# EAGLE schematic esp-4relay-board (EAGLE 7.7.0)
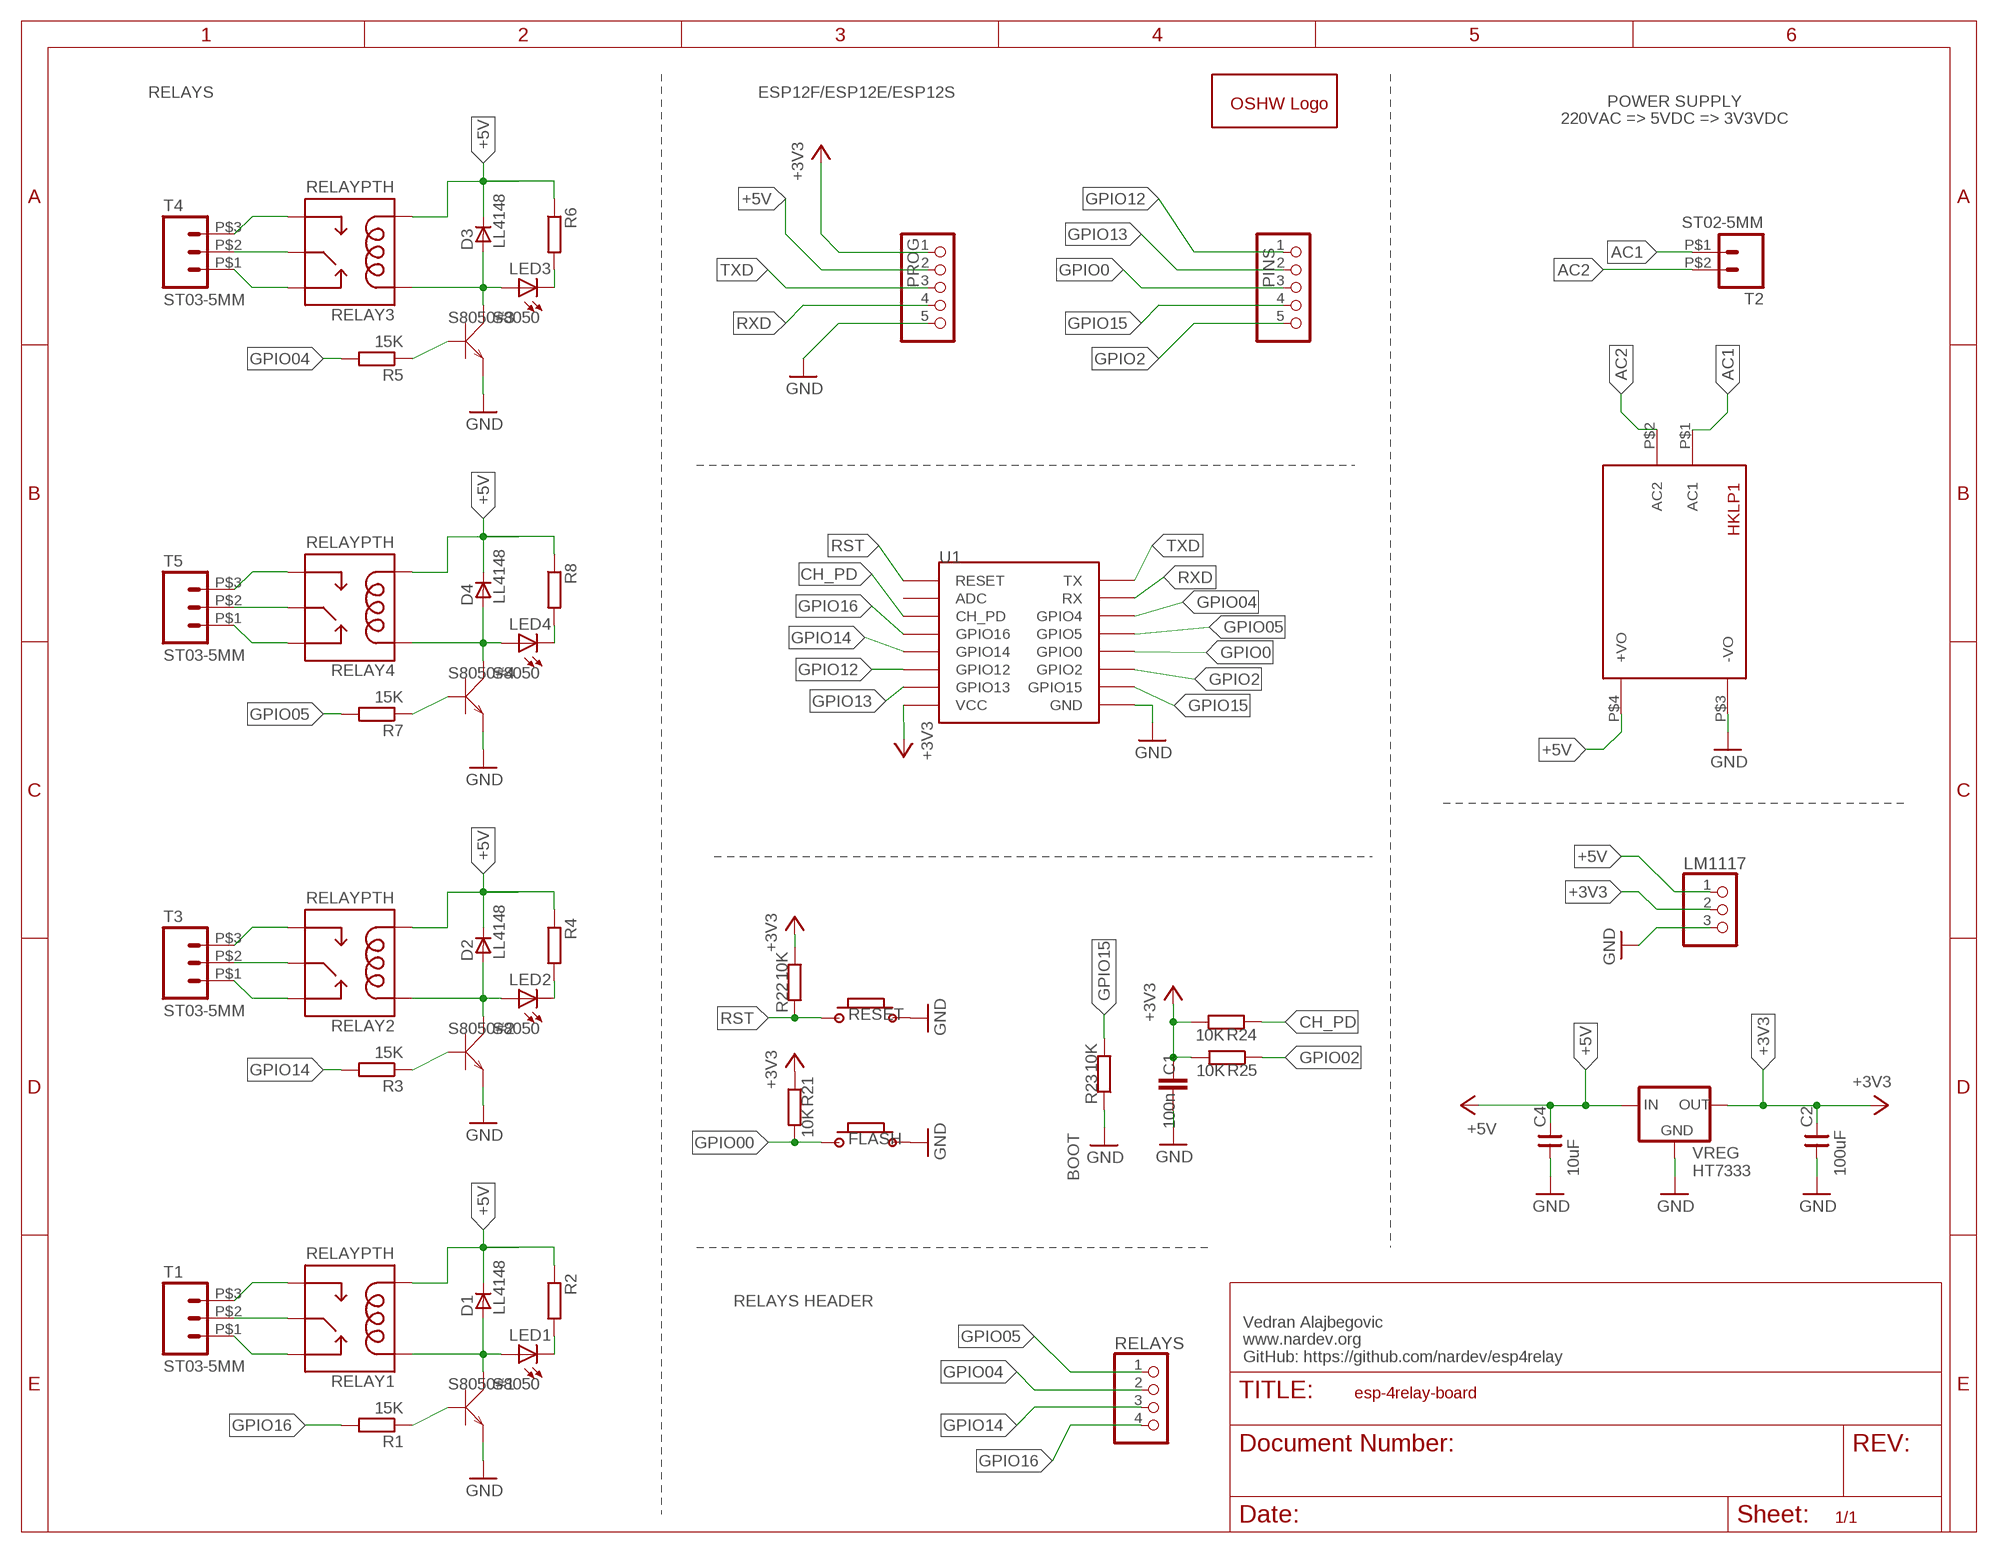
[diagram p0: schematic, sheet 1]

## Parts
C1  100n  CAPC0805  [C_0805]
C2  100uF  CNP-3216  [3216]
C4  10uF  CNP-3216  [3216]
D1  LL4148  [SOD80_DO213AA_MINIMELF]
D2  LL4148  [SOD80_DO213AA_MINIMELF]
D3  LL4148  [SOD80_DO213AA_MINIMELF]
D4  LL4148  [SOD80_DO213AA_MINIMELF]
FLASH  BUTTON-2PSWITCH-TURTLE-2P  [2P-SWITCH-TURTLE]
GOLD_ORB_SM1  OSHWLOGOLOGO16MM  [OSHW_16MM]
HKLP1  HKLPM01  [HKLPM01]
LED1  LEDSML0805  [SML0805]
LED2  LEDSML0805  [SML0805]
LED3  LEDSML0805  [SML0805]
LED4  LEDSML0805  [SML0805]
LM1117  PINHD-1X3  [1X03]
PINS  PINHD-1X5  [1X05]
PROG  PINHD-1X5  [1X05]
R1  15K  R-EU_R1206  [R1206]
R2  R-EU_R1206  [R1206]
R3  15K  R-EU_R1206  [R1206]
R4  R-EU_R1206  [R1206]
R5  15K  R-EU_R1206  [R1206]
R6  R-EU_R1206  [R1206]
R7  15K  R-EU_R1206  [R1206]
R8  R-EU_R1206  [R1206]
R21  10K  RESISTORR0805  [R_0805]
R22  10K  RESISTORR0805  [R_0805]
R23  10K  RESISTORR0805  [R_0805]
R24  10K  RESISTORR0805  [R_0805]
R25  10K  RESISTORR0805  [R_0805]
RELAY1  RELAYPTH  [SRD-05VDC-SL-C]
RELAY2  RELAYPTH  [SRD-05VDC-SL-C]
RELAY3  RELAYPTH  [SRD-05VDC-SL-C]
RELAY4  RELAYPTH  [SRD-05VDC-SL-C]
RELAYS  PINHD-1X4  [1X04]
RESET  BUTTON-2PSWITCH-TURTLE-2P  [2P-SWITCH-TURTLE]
S8050#1  S8050  SMD-TRANSISTORS-NPN-25V-500MW-S8050(SOT-23)  [SOT-23]
S8050#2  S8050  SMD-TRANSISTORS-NPN-25V-500MW-S8050(SOT-23)  [SOT-23]
S8050#3  S8050  SMD-TRANSISTORS-NPN-25V-500MW-S8050(SOT-23)  [SOT-23]
S8050#4  S8050  SMD-TRANSISTORS-NPN-25V-500MW-S8050(SOT-23)  [SOT-23]
T1  ST03-5MM  [EK500V-03P]
T2  ST02-5MM  [EK500V-02P]
T3  ST03-5MM  [EK500V-03P]
T4  ST03-5MM  [EK500V-03P]
T5  ST03-5MM  [EK500V-03P]
U1  ESP12SMD  [ESP12-SMD]
VREG  HT7333  [SOT-89]

## Nets
+3V3 [VCC]: C1.1 C2.2 LM1117.2 PROG.1 R21.1 R22.2 R24.2 R25.2 U1.VCC VREG.1(OUT)
+5V [VCC]: C4.2 D1.C D2.C D3.C D4.C HKLP1.P$4(+VO) LM1117.1 PROG.2 R2.1 R4.1 R6.1 R8.1 RELAY1.COIL0 RELAY2.COIL0 RELAY3.COIL0 RELAY4.COIL0 VREG.3(IN) VREG.4(IN)
AC1: HKLP1.P$1(AC1) T2.P$1
AC2: HKLP1.P$2(AC2) T2.P$2
CH_PD: R24.1 U1.CH_PD
GND: C1.2 C2.1 C4.1 FLASH.2 HKLP1.P$3(-VO) LM1117.3 PROG.5 R23.1 RESET.2 S8050#1.2(E) S8050#2.2(E) S8050#3.2(E) S8050#4.2(E) U1.GND VREG.2(GND)
GPIO0: PINS.3 U1.GPIO0
GPIO00: FLASH.1 R21.2
GPIO2: PINS.5 U1.GPIO2
GPIO02: R25.1
GPIO04: R5.2 RELAYS.2 U1.GPIO4
GPIO05: R7.2 RELAYS.1 U1.GPIO5
GPIO12: PINS.1 U1.GPIO12
GPIO13: PINS.2 U1.GPIO13
GPIO14: R3.2 RELAYS.3 U1.GPIO14
GPIO15: PINS.4 R23.2 U1.GPIO15
GPIO16: R1.2 RELAYS.4 U1.GPIO16
N$1: RELAY1.SWCLOSED(SWCLOSE) T1.P$1
N$2: R1.1 S8050#1.1(B)
N$3: RELAY1.SWCOMMON T1.P$2
N$4: D1.A LED1.A RELAY1.COIL1 S8050#1.3(C)
N$5: RELAY1.SWOPEN T1.P$3
N$6: D2.A LED2.A RELAY2.COIL1 S8050#2.3(C)
N$7: LED1.C R2.2
N$8: R3.1 S8050#2.1(B)
N$9: LED2.C R4.2
N$10: RELAY2.SWCOMMON T3.P$2
N$11: RELAY2.SWCLOSED(SWCLOSE) T3.P$1
N$12: RELAY2.SWOPEN T3.P$3
N$13: D3.A LED3.A RELAY3.COIL1 S8050#3.3(C)
N$14: R5.1 S8050#3.1(B)
N$15: LED3.C R6.2
N$16: RELAY3.SWCOMMON T4.P$2
N$17: RELAY3.SWCLOSED(SWCLOSE) T4.P$1
N$18: RELAY3.SWOPEN T4.P$3
N$19: D4.A LED4.A RELAY4.COIL1 S8050#4.3(C)
N$20: R7.1 S8050#4.1(B)
N$21: LED4.C R8.2
N$22: RELAY4.SWCOMMON T5.P$2
N$23: RELAY4.SWCLOSED(SWCLOSE) T5.P$1
N$24: RELAY4.SWOPEN T5.P$3
RST: R22.1 RESET.1 U1.RESET
RXD: PROG.4 U1.RXD0(RX)
TXD: PROG.3 U1.TXD0(TX)
Unconnected: U1.ADC

## Notes on the sheet
- RELAYS | ESP12F/ESP12E/ESP12S
- POWER SUPPLY
  220VAC => 5VDC => 3V3VDC
- BOOT
- RELAYS HEADER
- Vedran Alajbegovic
  www.nardev.org
  GitHub: https://github.com/nardev/esp4relay

## Library data of the parts
C1 = PRT-RCL:CAP
C2 C4 = cap-master:CNP-: NON-POLARIZED CAP
D1-D4 = _hhn_diodes_smd:LL4148: 1N4148 General Purpose Rectifie SMD-Version of 1N4148 Case: SOD 80 = DO 213 AA = MINIMELF (Glass) Author: Dipl.-Ing. FH Rainer Bayer HHN Hochschule Heilbronn, rainer.bayer@hs-heilbronn.de Ingenieurbüro ing-rb, mail@ing-rb.de
FLASH RESET = PRT-Switch:BUTTON-2P
GOLD_ORB_SM1 = oshw:OSHWLOGO: The OSHW logo for PCB layout
HKLP1 = HKLPM01:HKLPM01
LED1-LED4 = led:LED: LED OSRAM: - CHIPLED LG R971, LG N971, LY N971, LG Q971, LY Q971, LO R971, LY R971 LH N974, LH R974 LS Q976, LO Q976, LY Q976 LO Q996 - Hyper CHIPLED LW Q18S LB Q993, LB Q99A, LB R99A - SideLED LS A670, LO A670, LY A670, LG A670, LP A670 LB A673, LV A673, LT A673, LW A673 LH A674 LY A675 LS A676, LA A676, LO A676, LY A676, LW A676 LS A679, LY A679, LG A679 - Hyper Micro SIDELED® LS Y876, LA Y876, LO Y876, LY Y876 LT Y87S - SmartLED LW L88C, LW L88S LB L89C, LB L89S, LG L890 LS L89K, LO L89K, LY L89K LS L896, LA L896, LO L896, LY L896 - TOPLED LS T670, LO T670, LY T670, LG T670, LP T670 LSG T670, LSP T670, LSY T670, LOP T670, LYG T670 LG T671, LOG T671, LSG T671 LB T673, LV T673, LT T673, LW T673 LH T674 LS T676, LA T676, LO T676, LY T676, LB T676, LH T676, LSB T676, LW T676 LB T67C, LV T67C, LT T67C, LS T67K, LO T67K, LY T67K, LW E67C LS E67B, LA E67B, LO E67B, LY E67B, LB E67C, LV E67C, LT E67C LW T67C LS T679, LY T679, LG T679 LS T770, LO T770, LY T770, LG T770, LP T770 LB T773, LV T773, LT T773, LW T773 LH T774 LS E675, LA E675, LY E675, LS T675 LS T776, LA T776, LO T776, LY T776, LB T776 LHGB T686 LT T68C, LB T68C - Hyper Mini TOPLED® LB M676 - Mini TOPLED Santana® LG M470 LS M47K, LO M47K, LY M47K Source: http://www.osram.convergy.de LUXEON: - LUMILED® LXK2-PW12-R00, LXK2-PW12-S00, LXK2-PW14-U00, LXK2-PW14-V00 LXK2-PM12-R00, LXK2-PM12-S00, LXK2-PM14-U00 LXK2-PE12-Q00, LXK2-PE12-R00, LXK2-PE12-S00, LXK2-PE14-T00, LXK2-PE14-U00 LXK2-PB12-K00, LXK2-PB12-L00, LXK2-PB12-M00, LXK2-PB14-N00, LXK2-PB14-P00, LXK2-PB14-Q00 LXK2-PR12-L00, LXK2-PR12-M00, LXK2-PR14-Q00, LXK2-PR14-R00 LXK2-PD12-Q00, LXK2-PD12-R00, LXK2-PD12-S00 LXK2-PH12-R00, LXK2-PH12-S00 LXK2-PL12-P00, LXK2-PL12-Q00, LXK2-PL12-R00 Source: www.luxeon.com KINGBRIGHT: KA-3528ASYC Source: www.kingbright.com
LM1117 = pinhead:PINHD-1X3: PIN HEADER
PINS PROG = pinhead:PINHD-1X5: PIN HEADER
R1-R8 = resistor:R-EU_: RESISTOR, European symbol
R21-R25 = PRT-RCL:RESISTOR
RELAY1-RELAY4 = SRD-05VDC-SL-C:RELAY: SPDT relay (COM-00101)
RELAYS = pinhead:PINHD-1X4: PIN HEADER
S8050#1-S8050#4 = Seeed-Transistor-2016:SMD-TRANSISTORS-NPN-25V-500MW-S8050(SOT-23): 305010017; MPN: S8050
T1 T3-T5 = con-dinkle:ST03: Dinkle® Screw Terminal Block - 3 Way -5MM: EK500V series. Rated at 20A, 300VAC. Cable size: 2mm² Supplier: Altronics P2035A Source: http://www.dinkle.com/upfiles/proter21253708953.pdf -3.5MM: ED350V series. Rated at 10A, 300VAC. Cable size: 1.4mm² Supplier: Altronics P2029 Source: http://www.dinkle.com/upfiles/proter21253714491.pdf
T2 = con-dinkle:ST02: Dinkle® Screw Terminal Block - 2 Way -5MM: EK500V series. Rated at 20A, 300VAC. Cable size: 2mm² Supplier: Altronics P2034A Source: http://www.dinkle.com/upfiles/proter21253708953.pdf -5.08MM: The back half of a EK500V4R-04P. Rated at 20A, 300VAC. Cable size: 2mm² Supplier: Altronics P2024 (half of) Source: http://www.dinkle.com/upfiles/proter21253708833.pdf -3.5MM: ED350V series. Rated at 10A, 300VAC. Cable size: 1.4mm² Supplier: Altronics P2028 Source: http://www.dinkle.com/upfiles/proter21253714491.pdf
U1 = esp8266modules:ESP12: ESP8266 Wifi module 12
VREG = holtek2:HT73*

## Net classes
0 default: width 0.305 mm, drill 0.508 mm, clearance 0.254 mm
1 VCC: width 0.457 mm, clearance 0.254 mm